# Altium schematic sheet 3-Fuses.SchDoc
size A4
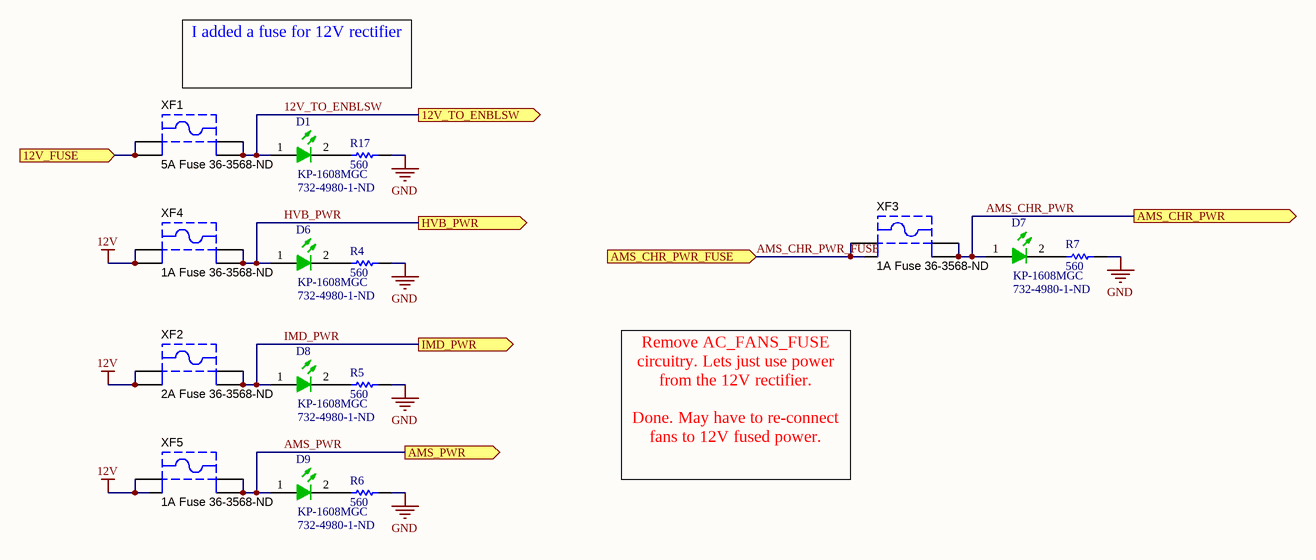
[diagram p0: 3-Fuses.SchDoc]

## Parts
D1  KP-1608MGC  Supplier Part Number 1: 732-4980-1-ND  [KING-0603LED_GREEN_V]
D6  KP-1608MGC  Supplier Part Number 1: 732-4980-1-ND  [KING-0603LED_GREEN_V]
D7  KP-1608MGC  Supplier Part Number 1: 732-4980-1-ND  [KING-0603LED_GREEN_V]
D8  KP-1608MGC  Supplier Part Number 1: 732-4980-1-ND  [KING-0603LED_GREEN_V]
D9  KP-1608MGC  Supplier Part Number 1: 732-4980-1-ND  [KING-0603LED_GREEN_V]
R4  560  [RESC0603(1608)_L]
R5  560  [RESC0603(1608)_L]
R6  560  [RESC0603(1608)_L]
R7  560  [RESC0603(1608)_L]
R17  560  [RESC0603(1608)_L]
XF1  5A Fuse 36-3568-ND  [KSTN-3568_V]
XF2  2A Fuse 36-3568-ND  [KSTN-3568_V]
XF3  1A Fuse 36-3568-ND  [KSTN-3568_V]
XF4  1A Fuse 36-3568-ND  [KSTN-3568_V]
XF5  1A Fuse 36-3568-ND  [KSTN-3568_V]

## Ports
12V_FUSE (in), 12V_TO_ENBLSW (out), AMS_CHR_PWR (out), AMS_CHR_PWR_FUSE (in), AMS_PWR (out), HVB_PWR (out), IMD_PWR (out)

## Nets
12V: XF2.1 XF2.2 XF4.1 XF4.2 XF5.1 XF5.2
GND: R4.2 R5.2 R6.2 R7.2 R17.2
12V_FUSE: XF1.1 XF1.2 ; port 12V_FUSE
12V_TO_ENBLSW: D1.1(A) XF1.3 XF1.4 ; port 12V_TO_ENBLSW
AMS_CHR_PWR: D7.1(A) XF3.3 XF3.4 ; port AMS_CHR_PWR
AMS_CHR_PWR_FUSE: XF3.1 XF3.2 ; port AMS_CHR_PWR_FUSE
AMS_PWR: D9.1(A) XF5.3 XF5.4 ; port AMS_PWR
HVB_PWR: D6.1(A) XF4.3 XF4.4 ; port HVB_PWR
IMD_PWR: D8.1(A) XF2.3 XF2.4 ; port IMD_PWR
NetD1_2: D1.2(K) R17.1
NetD6_2: D6.2(K) R4.1
NetD7_2: D7.2(K) R7.1
NetD8_2: D8.2(K) R5.1
NetD9_2: D9.2(K) R6.1

## Notes on the sheet
- I added a fuse for 12V rectifier
- Remove AC_FANS_FUSE circuitry. Lets just use power from the 12V rectifier.
  Done. May have to re-connect fans to 12V fused power.

## Library data of the parts
D1 D6-D9 = CMP-0404-00001-1: LED, SMT, 0603(1608), 1.1mm thickness, Green; Manufacturer: Kingbright; Reverse Voltage: 5 V; Power Dissipation: 75 mW; Forward Current: 30 mA; Packing Type: 2000 pcs / reel; Mounting Technology: Surface Mount; Storage Temperature: -40 to +85 degC; ComponentLink1URL: http://www.kingbright.com/; PackageDescription: 2-Pin SMT LED, 1.6 x 0.8 mm Pitch; PartNumber: KP-1608MGC; PackageReference: 0603LED_GREEN; ComponentLink1Description: Manufacturer URL; Supplier 1: Digi-Key
R4-R7 R17 = CMP-1591-00001-1: 0603 (1608 Metric) Chip Resistor; Case-Metric: 1608; Case-EIA: 0603; PackageReference: RESC0603(1608); Supplier 1: Digi-Key; Supplier Part Number 1: P560BZCT-ND
XF1-XF5 = CMP-2000-05464-1: Fuse Holder, 20 A, 500 V, -50 to 145 degC, 4-Pin THD, RoHS; Manufacturer: Keystone; Package Reference: 3568; Datasheet Version: 04/2013; Datasheet URL: https://datasheet.ciiva.com/16294/m60-2p40-16294706.pdf; Manufacturer URL: http://www.keyelco.com/; Mounting Technology: ThroughHole; Package Description: 4-Pin Through Hole Device, Body 16 x 6.73 mm, Pitch 9.9 mm